# EAGLE schematic schematic (EAGLE 9.6.2)
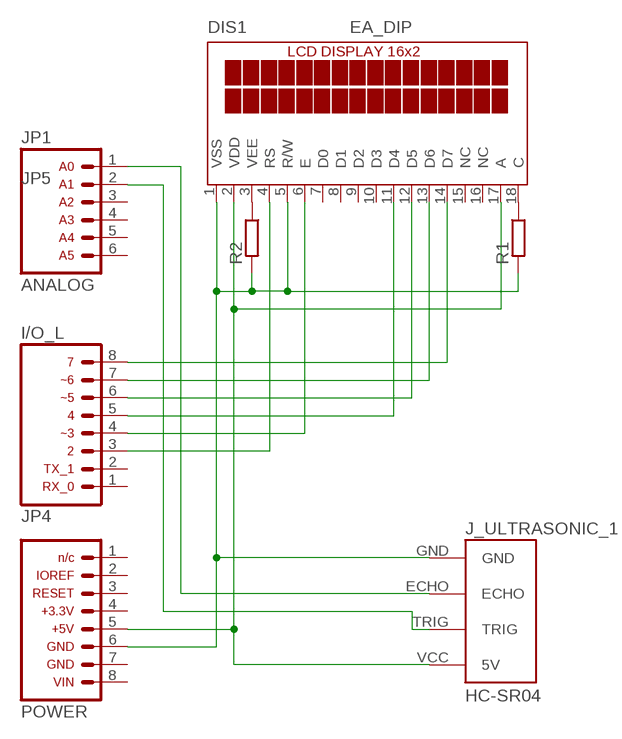
[diagram p0: schematic, sheet 1]

## Parts
DIS1  EA_DIP  [EA_DIP]
J_ULTRASONIC_1  HC-SR04  [HC-SR04_FOOTPRINT]
JP1  ARDUINO_CONN-ANALOGSIP  [CONN-1X06]
JP4  ARDUINO_CONN-IO_LSIP  [CONN-1X08]
JP5  ARDUINO_CONN-POWERSIP  [CONN-1X08]
R1  PMD  [PMD]
R2  PMD  [PMD]

## Nets
N$1: DIS1.14(D7) JP4.8
N$2: DIS1.13(D6) JP4.7
N$3: DIS1.12(D5) JP4.6
N$4: DIS1.11(D4) JP4.5
N$5: DIS1.18(C) R1.1
N$6: DIS1.3(VEE) R2.1
N$7: DIS1.1(VSS) DIS1.5(R/W) J_ULTRASONIC_1.GND JP5.6 R1.2 R2.2
N$8: DIS1.2(VDD) DIS1.17(A) J_ULTRASONIC_1.VCC(5V) JP5.5
N$9: J_ULTRASONIC_1.ECHO JP1.1
N$10: J_ULTRASONIC_1.TRIG JP1.2
N$11: DIS1.6(E) JP4.4
N$12: DIS1.4(RS) JP4.3
Unconnected: DIS1.7(D0) DIS1.8(D1) DIS1.9(D2) DIS1.10(D3) DIS1.15(NC) DIS1.16(NC) JP1.3 JP1.4 JP1.5 JP1.6 JP4.1 JP4.2 JP5.1 JP5.2 JP5.3 JP5.4 JP5.7 JP5.8

## Library data of the parts
DIS1 = display-lcd:EA_DIP: LCD-MODUL 2x16 - 6,68mm, INKL. KONTROLLER HD44780 Source: Data sheet <http://www.lcd-module.de/pdf/doma/dip162-d.pdf>
J_ULTRASONIC_1 = Ultrasonic Sensor HC-SR04:HC-SR04: Ultrasonic Sensor HC-SR04
JP1 = arduino_jw:ARDUINO_CONN-ANALOG: Arduino Analog I/O Header This is the analog I/O header on the Arduino Uno R3. This connector is labeled with the following pin assignments: Analog 0 Analog 1 Analog 2 Analog 3 Analog 4 Analog 5 NOTE: Be sure you install this connector with the correct orientation on your PCB layout. Pin 1 has a square pad to assist with orientation.
JP4 = arduino_jw:ARDUINO_CONN-IO_L: Arduino Digital I/O [Low Byte] Header This is the Digital I/O [low byte] header on the Arduino Uno R3. This connector is labeled with the following pin assignments: Digital 0, Serial Rx Digital 1, Serial Tx Digital 2 Digital 4 Digital 5 [PWM] Digital 6 [PWM] Digital 7 NOTE: Be sure you install this connector with the correct orientation on your PCB layout. Pin 1 has a square pad to assist with orientation.
JP5 = arduino_jw:ARDUINO_CONN-POWER: Arduino Power Header This is the power header on the Arduino Uno R3. This connector is labeled with the following pin assignments: n/c IO Ref RESET +3.3V +5V GND GND VIN NOTE: Be sure you install this connector with the correct orientation on your PCB layout. Pin 1 has a square pad to assist with orientation.
R1 R2 = resistor-shunt:PMD: SMD SHUNT RESISTOR; OC_FARNELL: unknown; OC_NEWARK: unknown